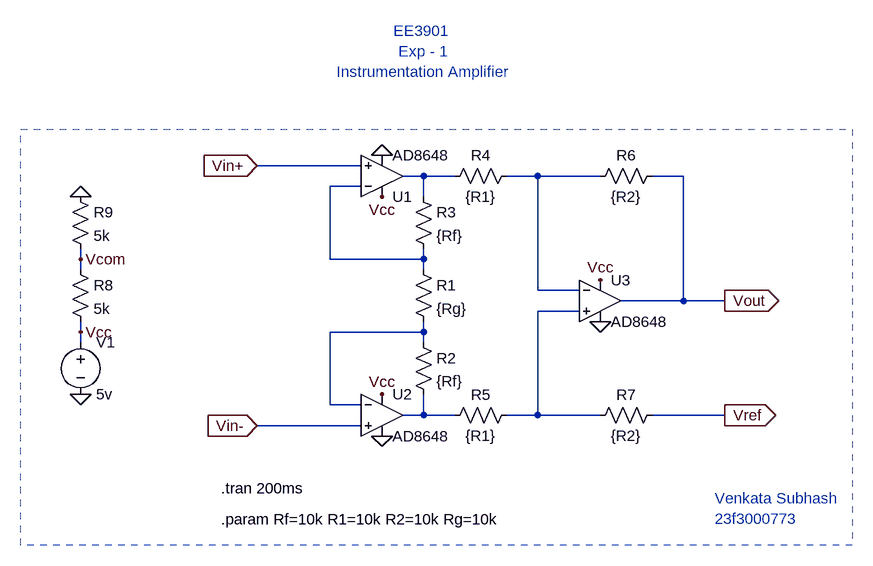
[diagram p0: schematic Week1 instrumentaion Amplifier.asc]
Week1 instrumentaion Amplifier.asc, the LTspice schematic file:
Version 4
SHEET 1 1016 680
WIRE 256 80 96 80
WIRE 352 96 320 96
WIRE 400 96 352 96
WIRE 528 96 480 96
WIRE 624 96 528 96
WIRE 752 96 704 96
WIRE 256 112 208 112
WIRE 352 128 352 96
WIRE -176 224 -176 208
WIRE 208 224 208 112
WIRE 352 224 352 208
WIRE 352 224 208 224
WIRE -176 240 -176 224
WIRE 352 240 352 224
WIRE 528 272 528 96
WIRE 592 272 528 272
WIRE 752 288 752 96
WIRE 752 288 656 288
WIRE 816 288 752 288
WIRE 592 304 528 304
WIRE -176 336 -176 320
WIRE 352 336 352 320
WIRE 352 336 208 336
WIRE -176 352 -176 336
WIRE 352 352 352 336
WIRE 208 448 208 336
WIRE 256 448 208 448
WIRE 352 464 352 432
WIRE 352 464 320 464
WIRE 400 464 352 464
WIRE 528 464 528 304
WIRE 528 464 480 464
WIRE 624 464 528 464
WIRE 816 464 704 464
WIRE 256 480 96 480
FLAG -176 432 0
FLAG 288 64 0
FLAG 288 496 0
FLAG 624 320 0
FLAG -176 336 Vcc
FLAG 288 128 Vcc
FLAG 288 432 Vcc
FLAG 624 256 Vcc
FLAG 96 80 Vin+
IOPIN 96 80 In
FLAG 96 480 Vin-
IOPIN 96 480 In
FLAG 816 288 Vout
IOPIN 816 288 Out
FLAG 816 464 Vref
IOPIN 816 464 Out
FLAG -176 224 Vcom
FLAG -176 128 0
SYMBOL AD8648 288 400 R0
SYMATTR InstName U2
SYMBOL AD8648 624 224 R0
SYMATTR InstName U3
SYMBOL Voltage -176 336 R0
SYMATTR InstName V1
SYMATTR Value 5v
SYMBOL AD8648 288 160 M180
SYMATTR InstName U1
SYMBOL Res 336 224 R0
SYMATTR InstName R1
SYMATTR Value {Rg}
SYMBOL Res 336 336 R0
SYMATTR InstName R2
SYMATTR Value {Rf}
SYMBOL Res 336 112 R0
SYMATTR InstName R3
SYMATTR Value {Rf}
SYMBOL Res 496 80 R90
WINDOW 0 0 56 VBottom 2
WINDOW 3 32 56 VTop 2
SYMATTR InstName R4
SYMATTR Value {R1}
SYMBOL Res 496 448 R90
WINDOW 0 0 56 VBottom 2
WINDOW 3 32 56 VTop 2
SYMATTR InstName R5
SYMATTR Value {R1}
SYMBOL Res 720 80 R90
WINDOW 0 0 56 VBottom 2
WINDOW 3 32 56 VTop 2
SYMATTR InstName R6
SYMATTR Value {R2}
SYMBOL Res 720 448 R90
WINDOW 0 0 56 VBottom 2
WINDOW 3 32 56 VTop 2
SYMATTR InstName R7
SYMATTR Value {R2}
SYMBOL Res -192 224 R0
SYMATTR InstName R8
SYMATTR Value 5k
SYMBOL Res -192 112 R0
SYMATTR InstName R9
SYMATTR Value 5k
TEXT 40 624 Left 2 !.param Rf=10k R1=10k R2=10k Rg=10k
TEXT 40 576 Left 2 !.tran 200ms
TEXT 352 -96 Center 2 ;EE3901 \nExp - 1\nInstrumentation Amplifier
TEXT 800 592 Left 2 ;Venkata Subhash \n23f3000773
RECTANGLE Normal -268 24 1012 664 2

The netlist it stands for:
* Week1 instrumentaion Amplifier.asc
XU2 Vin- N005 Vcc 0 N006 AD8648  ; pins In+ In- V+ V- OUT
XU3 N004 N002 Vcc 0 Vout AD8648  ; pins In+ In- V+ V- OUT
V1 Vcc 0 5v
XU1 Vin+ N003 Vcc 0 N001 AD8648  ; pins In+ In- V+ V- OUT
R1 N003 N005 {Rg}
R2 N005 N006 {Rf}
R3 N001 N003 {Rf}
R4 N002 N001 {R1}
R5 N004 N006 {R1}
R6 Vout N002 {R2}
R7 Vref N004 {R2}
R8 Vcom Vcc 5k
R9 0 Vcom 5k
.param Rf=10k R1=10k R2=10k Rg=10k
.tran 200ms
* EE3901
* Exp - 1
* Instrumentation Amplifier
* Venkata Subhash
* 23f3000773
.lib ADI.lib
.backanno
.end